# EAGLE design flatsat-breakout-aux (EAGLE 9.3.2)
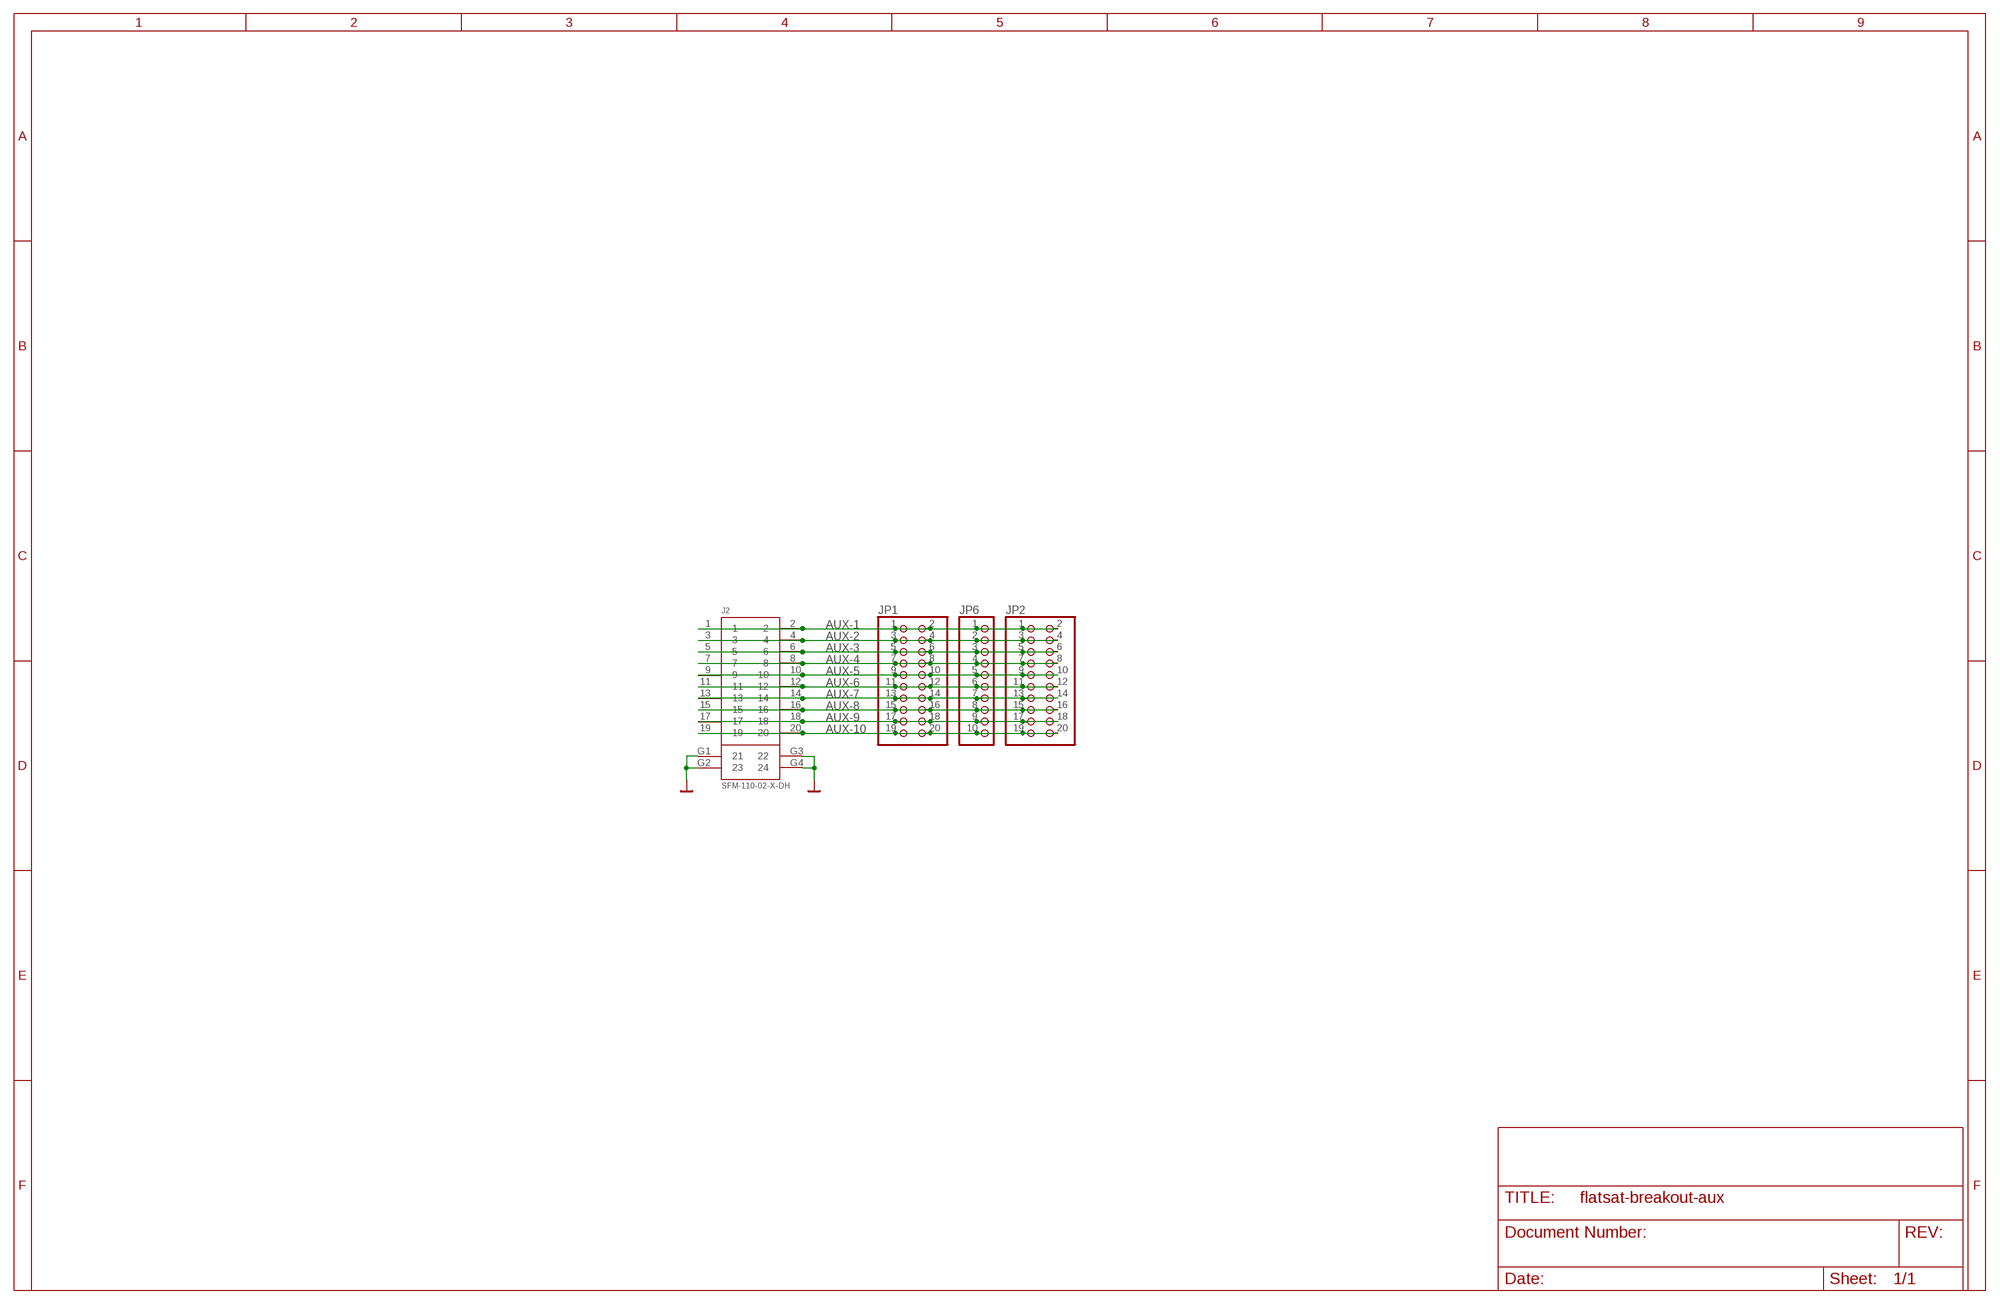
[diagram p0: schematic, sheet 1]

## Parts
J2  SFM-110-02-X-DH  [SFM-110-02-X-DH]
JP1  PINHD-2X10  [2X10]
JP2  PINHD-2X10  [2X10]
JP6  PINHD-1X10  [1X10]

## Nets
AUX-1: J2.1 J2.2 JP1.1 JP1.2 JP2.1 JP2.2 JP6.1
AUX-2: J2.3 J2.4 JP1.3 JP1.4 JP2.3 JP2.4 JP6.2
AUX-3: J2.5 J2.6 JP1.5 JP1.6 JP2.5 JP2.6 JP6.3
AUX-4: J2.7 J2.8 JP1.7 JP1.8 JP2.7 JP2.8 JP6.4
AUX-5: J2.9 J2.10 JP1.9 JP1.10 JP2.9 JP2.10 JP6.5
AUX-6: J2.11 J2.12 JP1.11 JP1.12 JP2.11 JP2.12 JP6.6
AUX-7: J2.13 J2.14 JP1.13 JP1.14 JP2.13 JP2.14 JP6.7
AUX-8: J2.15 J2.16 JP1.15 JP1.16 JP2.15 JP2.16 JP6.8
AUX-9: J2.17 J2.18 JP1.17 JP1.18 JP2.17 JP2.18 JP6.9
AUX-10: J2.19 J2.20 JP1.19 JP1.20 JP2.19 JP2.20 JP6.10
GND: J2.G1 J2.G2 J2.G3 J2.G4

## Library data of the parts
J2 = J-Samtec-SFM-110-02-X-DH:SFM-110-02-X-DH: 0.050"X0.050" SOCKET STRIP ASSEMBLY.
JP1 JP2 = pinhead:PINHD-2X10: PIN HEADER
JP6 = pinhead:PINHD-1X10: PIN HEADER

## Board
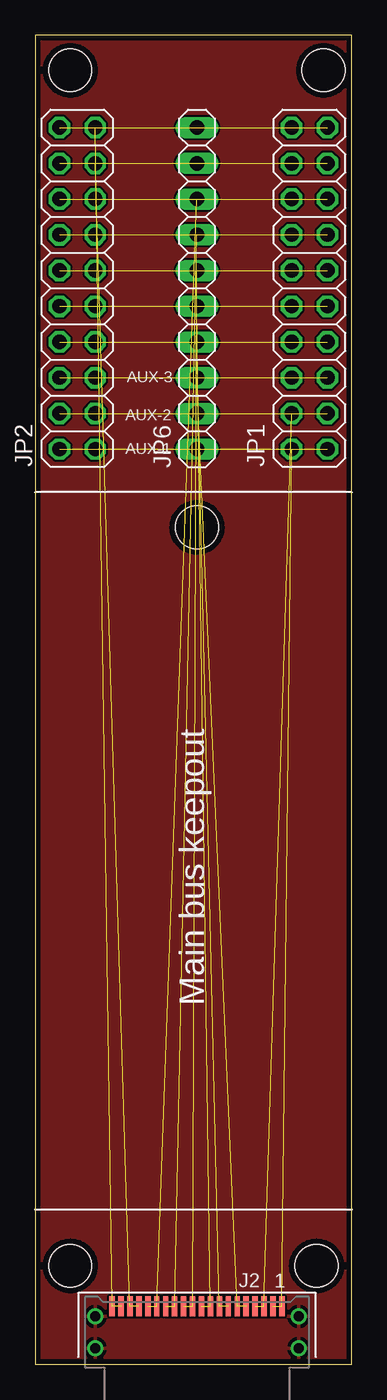
[diagram p1: board, top side]

Size 22.5 x 94.5 mm. Coordinates in mm from the lower left corner, seen from the top.
Outline: 0,0 22.5,0 22.5,94.5 0,94.5 0,0
Copper layers (1*16): Top 0.035559375mm / dielectric 1.6mm / Bottom 0.035559375mm
Design rules "oshpark-2layer-tented": minimum track width 6mil, minimum drill 10mil, track to track 6mil, track to pad 6mil, pad to pad 6mil, via to via 6mil, smd to smd 6mil, copper to edge 15mil, drill to drill 6mil, minimum pad ring 5mil, minimum via ring 5mil, stop-mask expansion 2.5mil, vias tented up to drill 20mil, thermal gap 10mil

### Footprints (pad centres in the part's own frame; a part is rotated, then mirrored left to right if it is on the bottom)
STAND-OFF-TIGHT = hole 3.048: 0,0
SFM-110-02-X-DH = smd 0.381 x 1.397: 1 -6.032,-4.128; 2 -5.397,-4.128; 3 -4.763,-4.128; 4 -4.128,-4.128; 5 -3.493,-4.128; 6 -2.857,-4.128; 7 -2.223,-4.128; 8 -1.587,-4.128; 9 -0.953,-4.128; 10 -0.318,-4.128; 11 0.318,-4.128; 12 0.953,-4.128; 13 1.587,-4.128; 14 2.223,-4.128; 15 2.857,-4.128; 16 3.493,-4.128; 17 4.128,-4.128; 18 4.763,-4.128; 19 5.397,-4.128; 20 6.032,-4.128 | drill 0.711 pad 1.143: G1 -7.239,-1.143; G2 7.239,-1.143; G3 -7.239,-3.404; G4 7.239,-3.404
2X10 = drill 1.016 octagon: 1 -11.43,-1.27; 2 -11.43,1.27; 3 -8.89,-1.27; 4 -8.89,1.27; 5 -6.35,-1.27; 6 -6.35,1.27; 7 -3.81,-1.27; 8 -3.81,1.27; 9 -1.27,-1.27; 10 -1.27,1.27; 11 1.27,-1.27; 12 1.27,1.27; 13 3.81,-1.27; 14 3.81,1.27; 15 6.35,-1.27; 16 6.35,1.27; 17 8.89,-1.27; 18 8.89,1.27; 19 11.43,-1.27; 20 11.43,1.27
1X10 = drill 1.016 long: 1 -11.43,0; 2 -8.89,0; 3 -6.35,0; 4 -3.81,0; 5 -1.27,0; 6 1.27,0; 7 3.81,0; 8 6.35,0; 9 8.89,0; 10 11.43,0

### Placement (x,y rotation side)
H1  STAND-OFFTIGHT  [STAND-OFF-TIGHT]  11.5,59.5 0 top
H2  STAND-OFFTIGHT  [STAND-OFF-TIGHT]  2.5,7 0 top
H3  STAND-OFFTIGHT  [STAND-OFF-TIGHT]  20,7 0 top
H4  STAND-OFFTIGHT  [STAND-OFF-TIGHT]  2.5,92 0 top
H5  STAND-OFFTIGHT  [STAND-OFF-TIGHT]  20.5,92 0 top
J2  11.5,0 180 top
JP1  19.5,76.5 90 top
JP2  3,76.5 90 top
JP6  11.5,76.5 90 top

### Tracks (layer width: path | path; a pad name or v marks a point on that pad's centre or on a via)
AUX-1  (6 unrouted)
AUX-2  (6 unrouted)
AUX-3  (6 unrouted)
AUX-4  (6 unrouted)
AUX-5  (6 unrouted)
AUX-6  (6 unrouted)
AUX-7  (6 unrouted)
AUX-8  (6 unrouted)
AUX-9  (6 unrouted)
AUX-10  (6 unrouted)
GND
  pour Top (rank 6): 0,0 0,94.5 22.5,94.5 22.5,0

### Text on the board
tPlace: AUX-3 | AUX-2 | AUX-1 | Main bus keepout